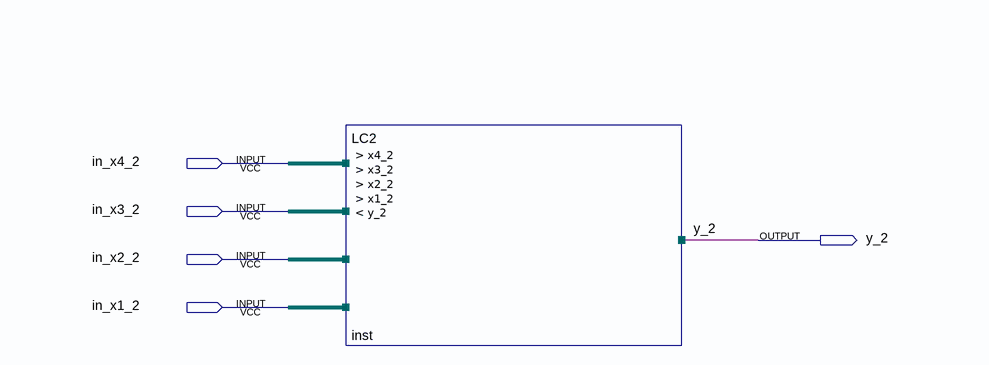
[diagram p0: schematic sheet]
// Quartus schematic CL_Dominskyi_v2.bdf as structural Verilog: 1 symbols, 5 pins
module CL_Dominskyi_v2 (
  input  in_x4_2,
  input  in_x3_2,
  input  in_x2_2,
  input  in_x1_2,
  output y_2
);

  LC2 inst (.x4_2(in_x4_2), .x3_2(in_x3_2), .x2_2(in_x2_2), .x1_2(in_x1_2), .y_2(y_2));
endmodule
